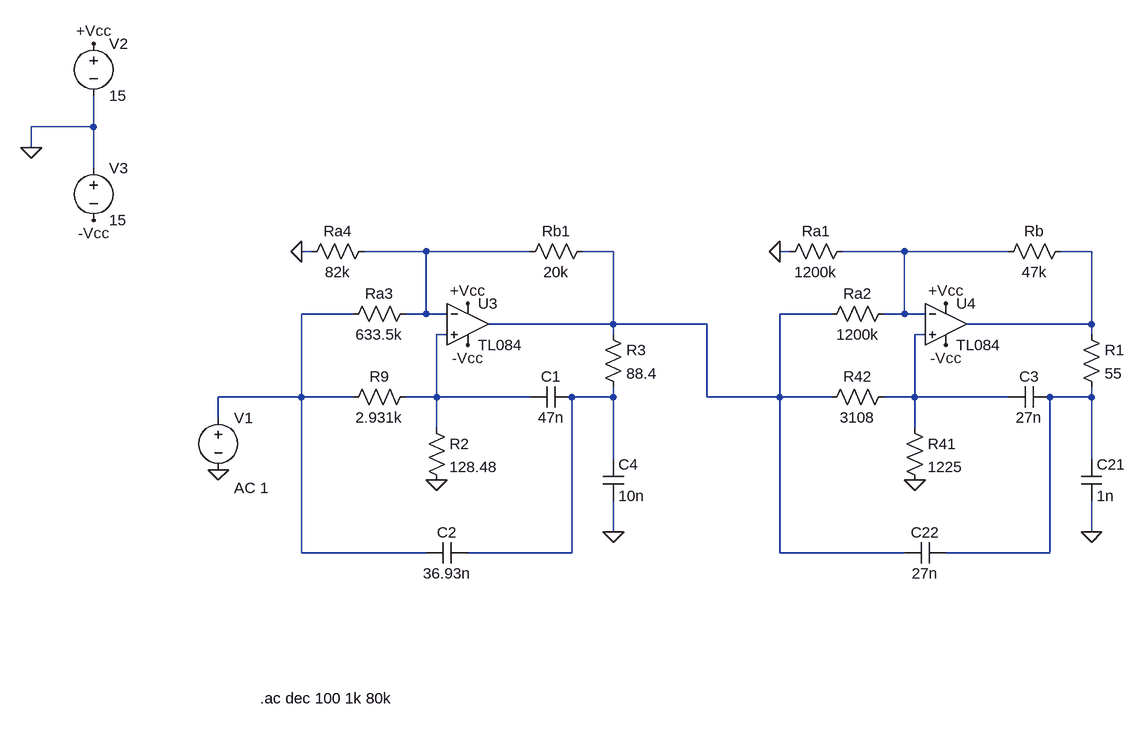
[diagram p0: schematic Sedra_complete_Test4.asc]
Sedra_complete_Test4.asc, the LTspice schematic file:
Version 4
SHEET 1 1620 680
WIRE -192 -480 -192 -528
WIRE -192 -480 -288 -480
WIRE -288 -448 -288 -480
WIRE -192 -416 -192 -480
WIRE 144 -288 128 -288
WIRE 320 -288 224 -288
WIRE 480 -288 320 -288
WIRE 608 -288 560 -288
WIRE 880 -288 864 -288
WIRE 1056 -288 960 -288
WIRE 1216 -288 1056 -288
WIRE 1344 -288 1296 -288
WIRE 208 -192 128 -192
WIRE 320 -192 320 -288
WIRE 320 -192 288 -192
WIRE 352 -192 320 -192
WIRE 944 -192 864 -192
WIRE 1056 -192 1056 -288
WIRE 1056 -192 1024 -192
WIRE 1088 -192 1056 -192
WIRE 608 -176 608 -288
WIRE 608 -176 416 -176
WIRE 752 -176 608 -176
WIRE 1344 -176 1344 -288
WIRE 1344 -176 1152 -176
WIRE 352 -160 336 -160
WIRE 608 -160 608 -176
WIRE 1088 -160 1072 -160
WIRE 1344 -160 1344 -176
WIRE 128 -64 128 -192
WIRE 128 -64 0 -64
WIRE 208 -64 128 -64
WIRE 336 -64 336 -160
WIRE 336 -64 288 -64
WIRE 480 -64 336 -64
WIRE 608 -64 608 -80
WIRE 608 -64 544 -64
WIRE 752 -64 752 -176
WIRE 864 -64 864 -192
WIRE 864 -64 752 -64
WIRE 944 -64 864 -64
WIRE 1072 -64 1072 -160
WIRE 1072 -64 1024 -64
WIRE 1216 -64 1072 -64
WIRE 1344 -64 1344 -80
WIRE 1344 -64 1280 -64
WIRE 0 -32 0 -64
WIRE 336 -16 336 -64
WIRE 1072 -16 1072 -64
WIRE 608 32 608 -64
WIRE 1344 32 1344 -64
WIRE 608 144 608 96
WIRE 1344 144 1344 96
WIRE 128 176 128 -64
WIRE 320 176 128 176
WIRE 544 176 544 -64
WIRE 544 176 384 176
WIRE 864 176 864 -64
WIRE 1056 176 864 176
WIRE 1280 176 1280 -64
WIRE 1280 176 1120 176
FLAG 0 48 0
FLAG 1072 64 0
FLAG 864 -288 0
FLAG 1344 144 0
FLAG -288 -448 0
FLAG 1120 -208 +Vcc
FLAG 1120 -144 -Vcc
FLAG -192 -608 +Vcc
FLAG -192 -336 -Vcc
FLAG 336 64 0
FLAG 128 -288 0
FLAG 608 144 0
FLAG 384 -208 +Vcc
FLAG 384 -144 -Vcc
SYMBOL voltage 0 -48 R0
WINDOW 123 24 124 Left 2
WINDOW 39 0 0 Left 0
SYMATTR Value2 AC 1
SYMATTR InstName V1
SYMATTR Value ""
SYMBOL res 1040 -80 R90
WINDOW 0 0 56 VBottom 2
WINDOW 3 32 56 VTop 2
SYMATTR InstName R42
SYMATTR Value 3108
SYMBOL res 1040 -208 R90
WINDOW 0 0 56 VBottom 2
WINDOW 3 32 56 VTop 2
SYMATTR InstName Ra2
SYMATTR Value 1200k
SYMBOL res 1056 -32 R0
SYMATTR InstName R41
SYMATTR Value 1225
SYMBOL cap 1280 -80 R90
WINDOW 0 0 32 VBottom 2
WINDOW 3 32 32 VTop 2
SYMATTR InstName C3
SYMATTR Value 27n
SYMBOL cap 1120 160 R90
WINDOW 0 0 32 VBottom 2
WINDOW 3 32 32 VTop 2
SYMATTR InstName C22
SYMATTR Value 27n
SYMBOL res 976 -304 R90
WINDOW 0 0 56 VBottom 2
WINDOW 3 32 56 VTop 2
SYMATTR InstName Ra1
SYMATTR Value 1200k
SYMBOL res 1312 -304 R90
WINDOW 0 0 56 VBottom 2
WINDOW 3 32 56 VTop 2
SYMATTR InstName Rb
SYMATTR Value 47k
SYMBOL cap 1328 32 R0
SYMATTR InstName C21
SYMATTR Value 1n
SYMBOL voltage -192 -624 R0
WINDOW 123 0 0 Left 0
WINDOW 39 0 0 Left 0
SYMATTR InstName V2
SYMATTR Value 15
SYMBOL voltage -192 -432 R0
WINDOW 123 0 0 Left 0
WINDOW 39 0 0 Left 0
SYMATTR InstName V3
SYMATTR Value 15
SYMBOL res 304 -80 R90
WINDOW 0 0 56 VBottom 2
WINDOW 3 32 56 VTop 2
SYMATTR InstName R9
SYMATTR Value 2.931k
SYMBOL res 304 -208 R90
WINDOW 0 0 56 VBottom 2
WINDOW 3 32 56 VTop 2
SYMATTR InstName Ra3
SYMATTR Value 633.5k
SYMBOL res 320 -32 R0
SYMATTR InstName R2
SYMATTR Value 128.48
SYMBOL cap 544 -80 R90
WINDOW 0 0 32 VBottom 2
WINDOW 3 32 32 VTop 2
SYMATTR InstName C1
SYMATTR Value 47n
SYMBOL cap 384 160 R90
WINDOW 0 0 32 VBottom 2
WINDOW 3 32 32 VTop 2
SYMATTR InstName C2
SYMATTR Value 36.93n
SYMBOL res 240 -304 R90
WINDOW 0 0 56 VBottom 2
WINDOW 3 32 56 VTop 2
SYMATTR InstName Ra4
SYMATTR Value 82k
SYMBOL res 576 -304 R90
WINDOW 0 0 56 VBottom 2
WINDOW 3 32 56 VTop 2
SYMATTR InstName Rb1
SYMATTR Value 20k
SYMBOL cap 592 32 R0
SYMATTR InstName C4
SYMATTR Value 10n
SYMBOL res 1328 -176 R0
SYMATTR InstName R1
SYMATTR Value 55
SYMBOL res 592 -176 R0
SYMATTR InstName R3
SYMATTR Value 88.4
SYMBOL sympropio\\TL084 384 -240 R0
SYMATTR InstName U3
SYMBOL sympropio\\TL084 1120 -240 R0
SYMATTR InstName U4
TEXT 64 400 Left 2 !.ac dec 100 1k 80k

The netlist it stands for:
* Sedra_complete_Test4.asc
V1 N005 0 AC 1
R42 N007 N002 3108
Ra2 N003 N002 1200k
R41 N007 0 1225
C3 N009 N007 27n
C22 N009 N002 27n
Ra1 N003 0 1200k
Rb N004 N003 47k
C21 N009 0 1n
V2 +Vcc 0 15
V3 0 -Vcc 15
R9 N006 N005 2.931k
Ra3 N001 N005 633.5k
R2 N006 0 128.48
C1 N008 N006 47n
C2 N008 N005 36.93n
Ra4 N001 0 82k
Rb1 N002 N001 20k
C4 N008 0 10n
R1 N004 N009 55
R3 N002 N008 88.4
* U3: TL084 (symbol sympropio\TL084 not available, pins judged from their places): In+=N006 In-=N001 V+=+Vcc V-=-Vcc OUT=N002
* U4: TL084 (symbol sympropio\TL084 not available, pins judged from their places): In+=N007 In-=N003 V+=+Vcc V-=-Vcc OUT=N004
.ac dec 100 1k 80k
.backanno
.end